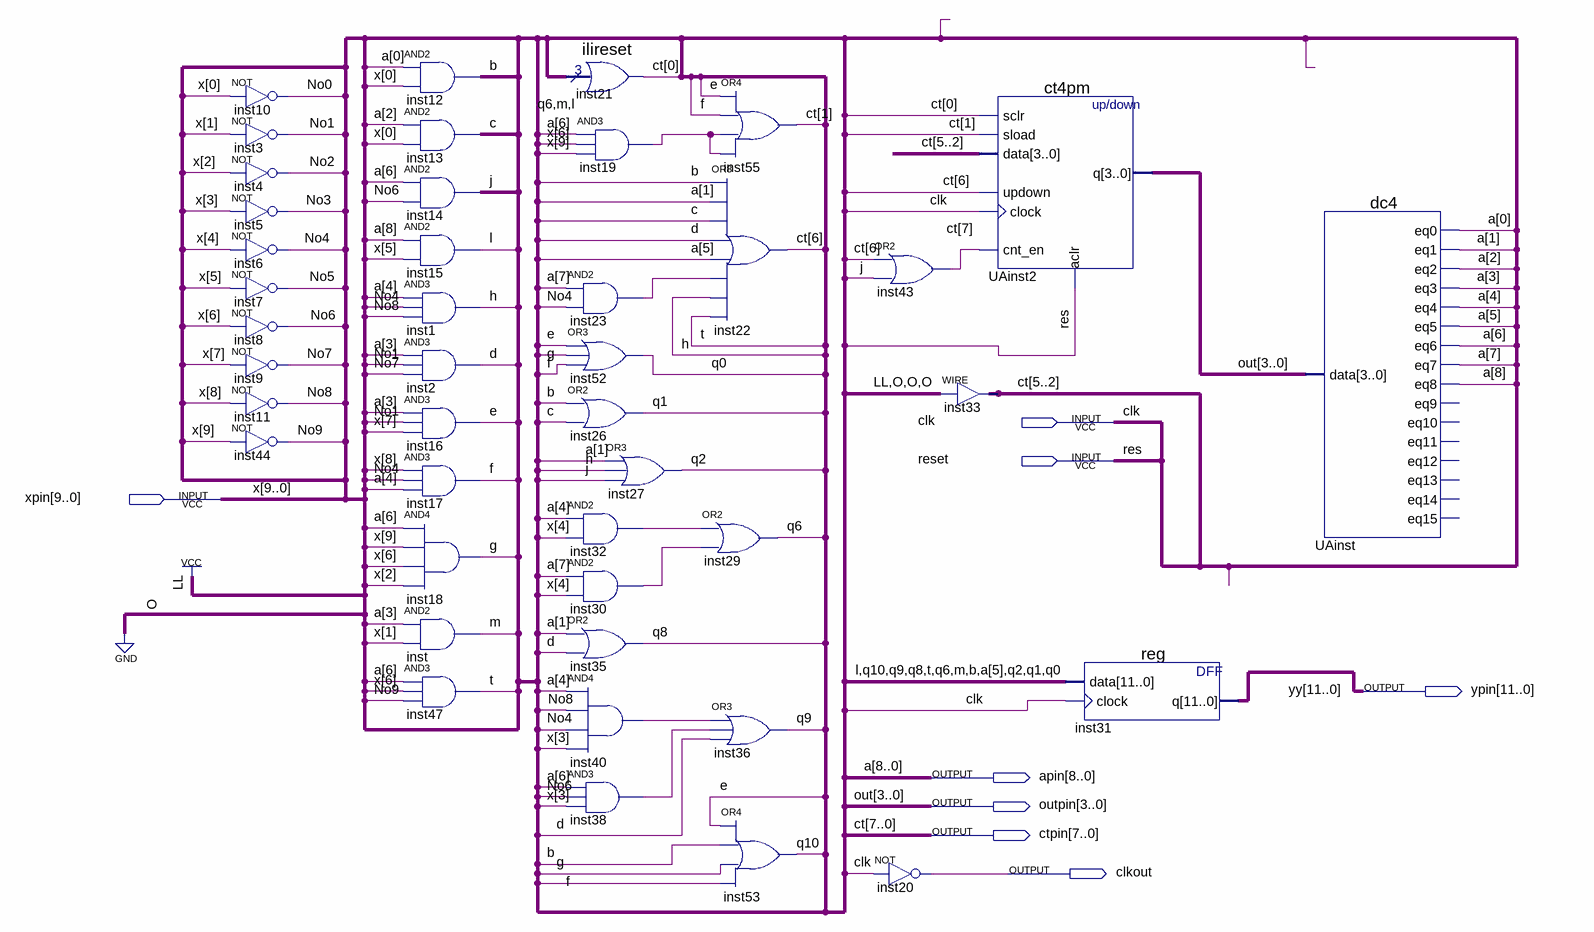
[diagram p0: schematic sheet]
// Quartus schematic UAcourseProject.bdf as structural Verilog: 43 symbols, 8 pins
module UAcourseProject (
  input  clk,
  input  reset,
  input  [9:0] xpin,
  output [11:0] ypin,
  output [8:0] apin,
  output [3:0] outpin,
  output [7:0] ctpin,
  output clkout
);

  wire b, c, d, e, f, g, h, inst19_out, inst23_out, inst30_out, inst32_out, inst38_out, inst40_out, j, l, m,
       No0, No1, No2, No3, No4, No5, No6, No7, No8, No9, q0, q1, q2, q6, q8, q9, q10, t;

  not inst10 (No0, xpin[0]);
  not inst3 (No1, xpin[1]);
  not inst4 (No2, xpin[2]);
  not inst5 (No3, xpin[3]);
  not inst6 (No4, xpin[4]);
  not inst7 (No5, xpin[5]);
  not inst8 (No6, xpin[6]);
  not inst9 (No7, xpin[7]);
  not inst11 (No8, xpin[8]);
  not inst44 (No9, xpin[9]);
  and inst12 (b, apin[0], xpin[0]);
  and inst13 (c, apin[2], xpin[0]);
  and inst14 (j, apin[6], No6);
  and inst15 (l, apin[8], xpin[5]);
  and inst1 (h, apin[4], No4, No8);
  and inst2 (d, apin[3], No1, No7);
  and inst16 (e, apin[3], No1, xpin[7]);
  and inst17 (f, xpin[8], No4, apin[4]);
  and inst18 (g, apin[6], xpin[9], xpin[6], xpin[2]);
  and inst (m, apin[3], xpin[1]);
  and inst47 (t, apin[6], xpin[6], No9);
  ilireset inst21 (.data({q6, m, l}), .result(ctpin[0]));
  and inst19 (inst19_out, apin[6], xpin[6], xpin[9]);
  and inst23 (inst23_out, apin[7], No4);
  or inst52 (q0, e, g, f);
  or inst26 (q1, b, c);
  and inst32 (inst32_out, apin[4], xpin[4]);
  and inst30 (inst30_out, apin[7], xpin[4]);
  or inst35 (q8, apin[1], d);
  and inst40 (inst40_out, apin[4], No8, No4, xpin[3]);
  and inst38 (inst38_out, apin[6], No6, xpin[3]);
  or inst27 (q2, apin[1], h, j);
  or inst55 (ctpin[1], e, f, inst19_out, inst19_out);
  or inst22 (ctpin[6], b, apin[1], c, d, apin[5], inst23_out, h, t);
  or inst29 (q6, inst32_out, inst30_out);
  or inst36 (q9, inst40_out, inst38_out, d);
  or inst53 (q10, e, b, g, f);
  or inst43 (ctpin[7], ctpin[6], j);
  not inst20 (clkout, clk);
  ct4pm UAinst2 (
    .sclr(ctpin[0]), .sload(ctpin[1]), .data(ctpin[5:2]), .updown(ctpin[6]), .clock(clk), .cnt_en(ctpin[7]),
    .aclr(reset), .q(outpin));
  assign ctpin[5:2] = 4'b1000;  // WIRE inst33
  \reg  inst31 (.data({l, q10, q9, q8, t, q6, m, b, apin[5], q2, q1, q0}), .clock(clk), .q(ypin));
  dc4 UAinst (
    .data(outpin), .eq0(apin[0]), .eq1(apin[1]), .eq2(apin[2]), .eq3(apin[3]), .eq4(apin[4]), .eq5(apin[5]),
    .eq6(apin[6]), .eq7(apin[7]), .eq8(apin[8]));  // open: eq9, eq10, eq11, eq12, eq13, eq14, eq15

  // Other names for the same wires on the sheet: a[8:0] = apin; ct[7:0] = ctpin; out[3:0] = outpin; res = reset;
  //   x[9:0] = xpin; yy[11:0] = ypin
endmodule
